# Altium schematic sheet Sheet2.SchDoc
size A0; SheetNumber: 1; SheetTotal: 1
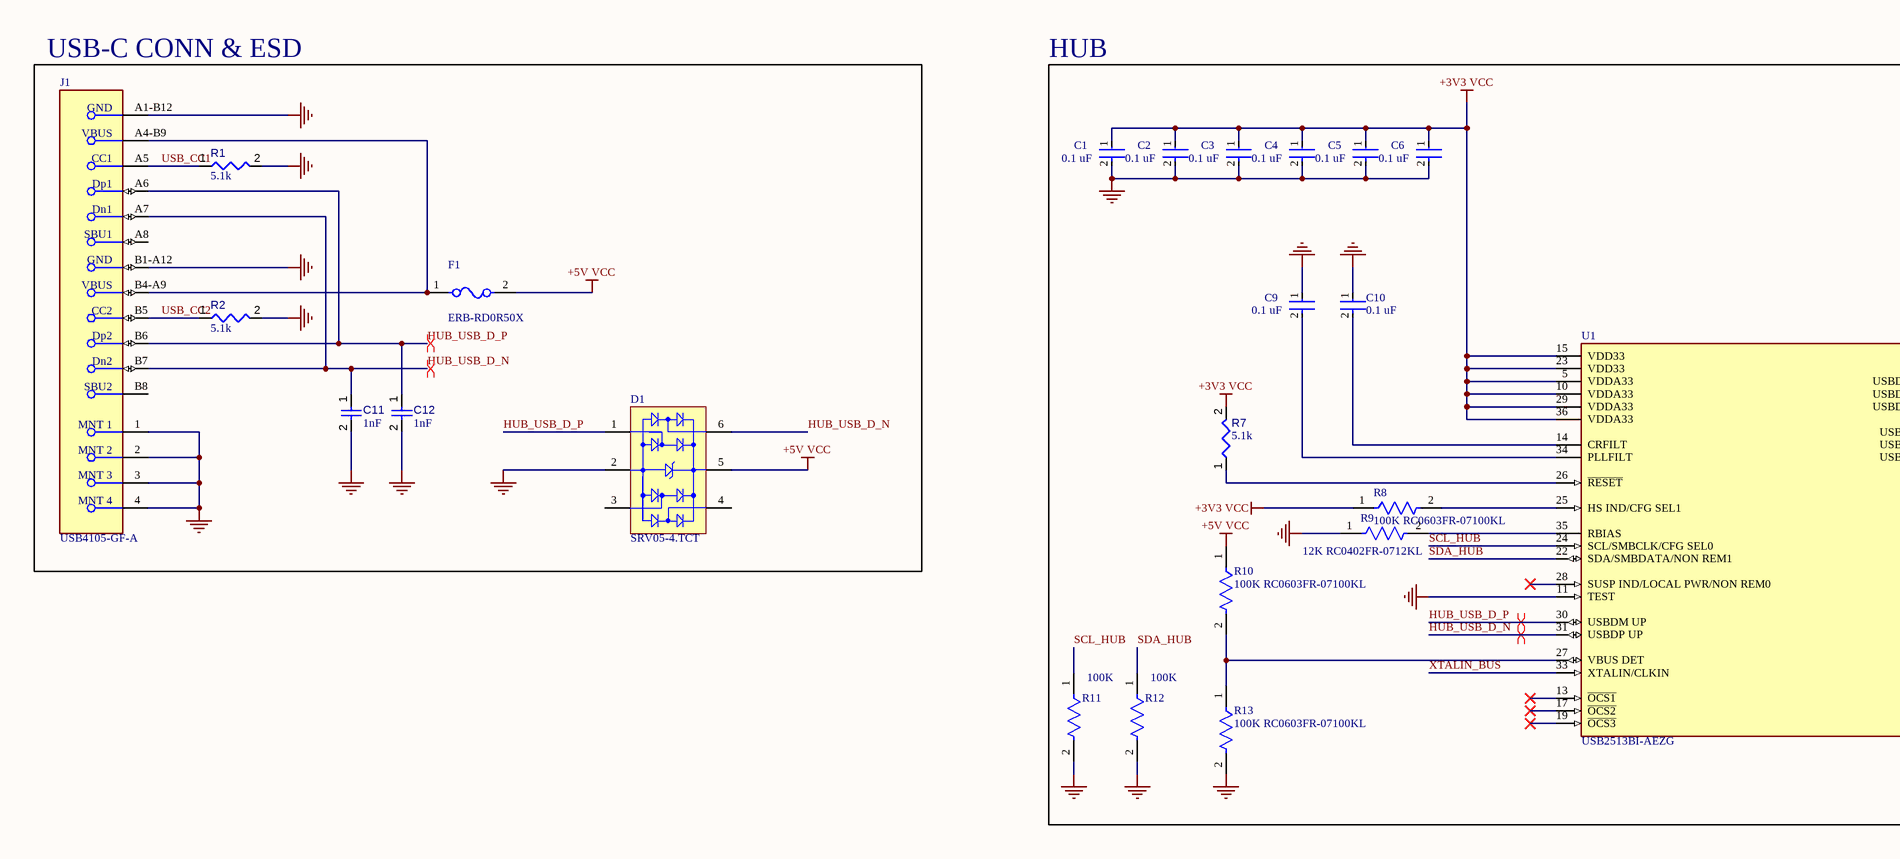
[diagram p0: Sheet2.SchDoc, left]
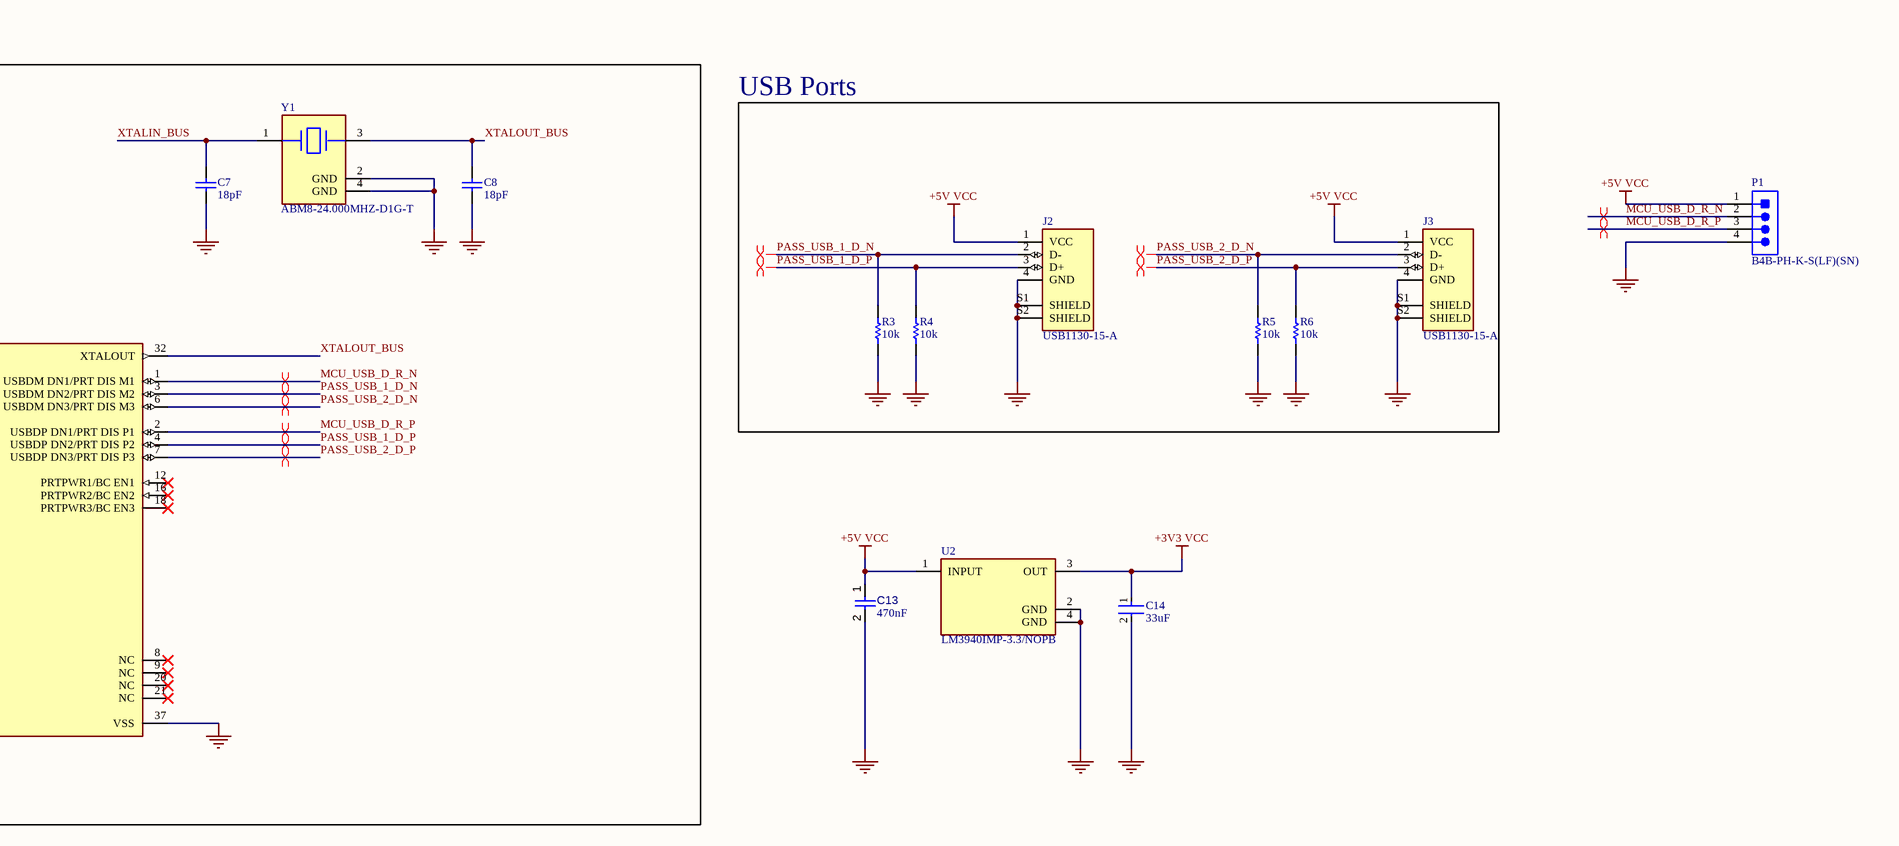
[diagram p1: Sheet2.SchDoc, right]

## Parts
C1  0.1 uF  [FP-GRM15-MFG]
C2  0.1 uF  [FP-GRM15-MFG]
C3  0.1 uF  [FP-GRM15-MFG]
C4  0.1 uF  [FP-GRM15-MFG]
C5  0.1 uF  [FP-GRM15-MFG]
C6  0.1 uF  [FP-GRM15-MFG]
C7  18pF  [CAPC1608X90X35LL10T15]
C8  18pF  [CAPC1608X90X35LL10T15]
C9  0.1 uF  [FP-GRM15-MFG]
C10  0.1 uF  [FP-GRM15-MFG]
C11  value 1nF  [CAPC0402(1005)33_L]  (hidden comment: Capacitor 1nF +/-20% 50V 0402)
C12  value 1nF  [CAPC0402(1005)33_L]  (hidden comment: Capacitor 1nF +/-20% 50V 0402)
C13  value 470nF  [CAPC0603(1608)100_L]  (hidden comment: Capacitor 470nF +/-20% 25V 0603)
C14  33uF  [FP-C2012-125-0_2-IPC_A]
D1  SRV05-4.TCT  [SMTC-SOT23-6_V]
F1  ERB-RD0R50X  [FP-ERBRD-MFG]
J1  USB4105-GF-A  [FP-USB4105-GF-A-MFG]
J2  USB1130-15-A  [GCT_USB1130-15-A_REVA]
J3  USB1130-15-A  [GCT_USB1130-15-A_REVA]
P1  B4B-PH-K-S(LF)(SN)  [JST-B4B-PH-K-S_V]
R1  value 5.1k  [RESC1005X40X25NL05T10]  (hidden comment: RC0402FR-075K1L)
R2  value 5.1k  [RESC1005X40X25NL05T10]  (hidden comment: RC0402FR-075K1L)
R3  10k  [RESC1005X40X25ML05T05]
R4  10k  [RESC1005X40X25ML05T05]
R5  10k  [RESC1005X40X25ML05T05]
R6  10k  [RESC1005X40X25ML05T05]
R7  value 5.1k  [RESC1005X40X25NL05T10]  (hidden comment: RC0402FR-075K1L)
R8  100K RC0603FR-07100KL  [FP-RC0603-0_55-MFG]
R9  12K RC0402FR-0712KL  [FP-RC0402-0_4-IPC_C]
R10  100K RC0603FR-07100KL  [FP-RC0603-0_55-MFG]
R11  100K  [FP-RC0603-0_55-MFG]
R12  100K  [FP-RC0603-0_55-MFG]
R13  100K RC0603FR-07100KL  [FP-RC0603-0_55-MFG]
U1  USB2513BI-AEZG  [FP-USB2513BI-AEZG-MFG]
U2  LM3940IMP-3.3/NOPB  [FP-DCY0004A-MFG]
Y1  ABM8-24.000MHZ-D1G-T  [FP-ABM8-MFG]

## Blocks framed on the sheet
USB-C CONN & ESD: C11 C12 D1 F1 J1 R1 R2
HUB: C1-C10 R7-R13 U1 Y1
USB Ports: J2 J3 R3-R6

## Nets
+3V3 VCC: C1.1 C2.1 C3.1 C4.1 C5.1 C6.1 C14.1 R7.2 R8.1 U1.5(VDDA33) U1.10(VDDA33) U1.15(VDD33) U1.23(VDD33) U1.29(VDDA33) U1.36(VDDA33) U2.3(OUT)
+5V VCC: C13.1 D1.5(VBUS) F1.2 J2.1(VCC) J3.1(VCC) P1.1 R10.1 U2.1(INPUT)
GND: C1.2 C2.2 C3.2 C4.2 C5.2 C6.2 C7.1 C8.1 C9.1 C10.1 C11.2 C12.2 C13.2 C14.2 D1.2(GND) J1.1(MNT_1) J1.2(MNT_2) J1.3(MNT_3) J1.4(MNT_4) J1.A1-B12(GND) J1.B1-A12(GND) J2.4(GND) J2.S1(SHIELD) J2.S2(SHIELD) J3.4(GND) J3.S1(SHIELD) J3.S2(SHIELD) P1.4 R1.2 R2.2 R3.1 R4.1 R5.1 R6.1 R9.1 R11.2 R12.2 R13.2 U1.11(TEST) U1.37(VSS) U2.2(GND) U2.4(GND) Y1.2(GND) Y1.4(GND)
HUB_USB_D_N: C11.1 D1.6(I/O_4) J1.A7(Dn1) J1.B7(Dn2) U1.31(USBDP_UP)
HUB_USB_D_P: C12.1 D1.1(I/O_1) J1.A6(Dp1) J1.B6(Dp2) U1.30(USBDM_UP)
MCU_USB_D_R_N: P1.2 U1.1(USBDM_DN1/PRT_DIS_M1)
MCU_USB_D_R_P: P1.3 U1.2(USBDP_DN1/PRT_DIS_P1)
PASS_USB_1_D_N: J2.2(D-) R3.2 U1.3(USBDM_DN2/PRT_DIS_M2)
PASS_USB_1_D_P: J2.3(D+) R4.2 U1.4(USBDP_DN2/PRT_DIS_P2)
PASS_USB_2_D_N: J3.2(D-) R5.2 U1.6(USBDM_DN3/PRT_DIS_M3)
PASS_USB_2_D_P: J3.3(D+) R6.2 U1.7(USBDP_DN3/PRT_DIS_P3)
SCL_HUB: R11.1 U1.24(SCL/SMBCLK/CFG_SEL0)
SDA_HUB: R12.1 U1.22(SDA/SMBDATA/NON_REM1)
USB_CC1: J1.A5(CC1) R1.1
USB_CC2: J1.B5(CC2) R2.1
XTALIN_BUS: C7.2 U1.33(XTALIN/CLKIN) Y1.1
XTALOUT_BUS: C8.2 U1.32(XTALOUT) Y1.3
NetC9_2: C9.2 U1.34(PLLFILT)
NetC10_2: C10.2 U1.14(CRFILT)
NetF1_1: F1.1 J1.A4-B9(VBUS) J1.B4-A9(VBUS)
NetR7_1: R7.1 U1.26(~{RESET})
NetR8_2: R8.2 U1.25(HS_IND/CFG_SEL1)
NetR9_2: R9.2 U1.35(RBIAS)
NetR10_2: R10.2 R13.1 U1.27(VBUS_DET)

Not connected (* = marked no-connect by the designer): D1 3(I/O_2) 4(I/O_3); J1 A8(SBU1) B8(SBU2); U1 8(NC)* 9(NC)* 12(PRTPWR1/BC_EN1)* 13(~{OCS1})* 16(PRTPWR2/BC_EN2)* 17(~{OCS2})* 18(PRTPWR3/BC_EN3)* 19(~{OCS3})* 20(NC)* 21(NC)* 28(SUSP_IND/LOCAL_PWR/NON_REM0)*

## Layout directives
differential pair: HUB_USB_D_N, HUB_USB_D_P, MCU_USB_D_R_N, MCU_USB_D_R_P, PASS_USB_1_D_N, PASS_USB_1_D_P, PASS_USB_2_D_N, PASS_USB_2_D_P

## Library data of the parts
C1-C6 C9 = CMP-2100-03641-2: CAP CER 0.1UF 16V X7R 0402 / GRM155R71C104KA88D; Manufacturer: Murata; Standoff Height: 0mm; Tolerance: 10%; Voltage Rating: 16Vdc; Material: Ceramic; Capacitance: 0.10μF; Value: 0.10μF; RoHS: TRUE; Manufacturer Part Number: GRM155R71C104KA88D; Temperature Characteristic: X7R; Octopart: https://octopart.com/grm155r71c104ka88d-murata-196880; Digikey Description: CAP CER 0.1UF 16V X7R 0402; Device Class L3: Ceramic Capacitors; Height: 0.55mm; ComponentLink2Description: Datasheet; Temperature Range Low: -55°C; Ipc Land Pattern Name: CAPC10050X219; ComponentLink2URL: https://search.murata.co.jp/Ceramy/image/img/A01X/G101/ENG/GRM155R71H471KA01-01A.pdf; Device Class L1: Passive Components; Lead Free: yes; Category: Cap; Package: GRM15; Temperature: -55°C to +125°C; Device Class L2: Capacitors; Temperature Range High: +125°C; Mouser Description: 0402 0.1 uF 16V ±10 % Tolerance X7R SMT Multilayer Ceramic Capacitor
C7 C8 = CMP-2000-06334-1: Chip Capacitor, 18 pF, +/- 5%, 50 V, -55 to 125 degC, 0603 (1608 Metric), RoHS, Tape and Reel / GRM1885C1H180JA01D; Manufacturer: Murata; Voltage - Rated: 50V; Online Catalog: GRMSeries; Temperature Coefficient: C0G,NP0; Other Names: 490-1409-2GRM39C0G180J050AD; Capacitance: 18pF; Package / Case: 0603(1608Metric); Package Reference: 0603; Height - Seated (Max): -; Package Description: 2-Pin Surface Mount Device, Body 1.6 x 0.8 mm; Category: Capacitors; Applications: GeneralPurpose; Size / Dimension: 0.063"Lx0.031"W(1.60mmx0.80mm); Mounting Type: SurfaceMount,MLCC; Family: CeramicCapacitors; Packaging: Tape&Reel(TR); Tolerance: ±5%; Ratings: -; Operating Temperature: -55°C~125°C; Datasheet URL: http://search.murata.co.jp/Ceramy/image/img/A01X/G101/ENG/GRM1885C1H180JA01-01.pdf; Standard Package: 4,000; Lead Style: -; Thickness (Max): 0.035"(0.90mm); Manufacturer URL: http://www.murata.com/; Mounting Technology: SurfaceMount; Lead Spacing: -; Series: GRM; Features: -; Datasheet Version: 03/2016
C10 = CMP-2100-03641-2: CAP CER 0.1UF 16V X7R 0402; Manufacturer Part Number: GRM155R71C104KA88D; Manufacturer: Murata; Standoff Height: 0mm; Tolerance: 10%; Voltage Rating: 16Vdc; Material: Ceramic; Capacitance: 0.10μF; Value: 0.10μF; RoHS: TRUE; Temperature Characteristic: X7R; Octopart: https://octopart.com/grm155r71c104ka88d-murata-196880; Digikey Description: CAP CER 0.1UF 16V X7R 0402; Device Class L3: Ceramic Capacitors; Height: 0.55mm; ComponentLink2Description: Datasheet; Temperature Range Low: -55°C; Ipc Land Pattern Name: CAPC10050X219; ComponentLink2URL: https://search.murata.co.jp/Ceramy/image/img/A01X/G101/ENG/GRM155R71H471KA01-01A.pdf; Device Class L1: Passive Components; Lead Free: yes; Category: Cap; Package: GRM15; Temperature: -55°C to +125°C; Device Class L2: Capacitors; Temperature Range High: +125°C; Mouser Description: 0402 0.1 uF 16V ±10 % Tolerance X7R SMT Multilayer Ceramic Capacitor
C11 C12 = CMP-001-00066-3: Chip Capacitor, 1nF +/-20%, 50V, 0402, Thickness 0.33 mm; Tolerance: 10%; Case/Package: 0402; Pins: 2; Min Operating Temperature: -55°C; Max Operating Temperature: 85°C; Voltage Rating: 50V; Mounting Technology: SMT
C13 = CMP-001-00077-3: Chip Capacitor, 470nF +/-20%, 25V, 0603, Thickness 1 mm; Tolerance: 10%; Max Operating Temperature: 85°C; Voltage Rating: 25V; Pins: 2; Case/Package: 0603; Mounting Technology: SMT; Min Operating Temperature: -55°C
C14 = CMP-08246-003796-1: Multilayer Ceramic Capacitors 33μF ±20% 6.3V X5R SMD 0805 / C2012X5R0J336M125AC; Series: C; Capacitance: 33uF; Min Operating Temperature: -55°C; Depth: 1.25mm; Radiation Hardening: No; Package Quantity: 1; Height: 1.25mm; Max Operating Temperature: 85°C; REACH SVHC: No SVHC; Mount: Surface Mount; Construction: Flat; Case/Package: 0805; Dielectric Material: Ceramic; Thickness: 0.057inch; Case Code (Imperial): 0805; Lead Free: Lead Free; Weight: 0.000194oz; Case Code (Metric): 2012; Tolerance: 20%; Dielectric: X5R; RoHS Compliant: Yes; Length: 2mm; Packaging: Tape and Reel; Voltage Rating (DC): 6.3V; Width: 1.2mm; Resistor Type: Ceramic; Termination: SMD/SMT; Voltage Rating: 6.3V
D1 = CMP-2000-05358-1: RailClamp(R) Low Capacitance TVS Diode Array, 5 pF, 17.5 VC, -55 to 125 degC, 6-Pin SOT23, RoHS, Tape and Reel; Manufacturer: Semtech; Leakage Current (Max): 5uA; Polarity: Uni-Directional; Peak Pulse Power Dissipation: 300W; Clamping Voltage: 17.5V; Number of Elements: 1; Working Voltage: 5V; Test Current (It): 1mA; Configuration: Quad; Reverse Breakdown Voltage: 6V; Suppressor Type: DiodeArrays; Peak Pulse Current: 12A; Product Depth (mm): 1.6mm; Product Height (mm): 1.15mm; Clamping Voltage (Max): 12.5V; Rad Hardened: No; Product Length (mm): 2.9mm; Capacitance Value: 5pF; Mounting: SurfaceMount; Datasheet URL: https://datasheet.ciiva.com/8029/srv05-4-8029973.pdf; Datasheet Version: Jan-08; Packaging: TapeandReel; Package / Case: SOT-23; Operating Temp Range: -55Cto125C; Pin Count: 6; Direction Type: Uni-Directional; Operating Temperature Min Deg. C: -55C; Reverse Stand-off Voltage: 5V; Leakage Current: 5uA; Manufacturer URL: http://www.semtech.com/; Working Voltage (Max): 5V; Package Reference: SOT23-6; Package Description: 6-Pin Small Outline Transistor, Body 2.9 x 1.6 mm, Pitch 0.95 mm; Operating Temperature Max Deg. C: 125C; Operating Temperature Classification: Military; Mounting Style: SurfaceMount
F1 = CMP-05590-000002-1: FUSE BOARD MNT 500MA 32VDC 0402; Manufacturer: Panasonic Electronic Components; Fuse Current: 0.5A; Fuse Blow Speed: Fast; Voltage Rating: 32V; Value: 310mΩ; Fuse Interrupt Dc Current: 35A; RoHS: TRUE; ComponentLink2Description: Datasheet; Temperature Range High: +125°C; Temperature: -40°C to +125°C; Mouser Description: Fuse Chip Fast Acting 0.5A 32V SMD Solder Pad 0402 1 X 0.5 X 0.39mm T/R UL/cUL; Digikey Description: FUSE BOARD MNT 500MA 32VDC 0402; Device Class L2: Fuses; Temperature Range Low: -40°C; Ipc Land Pattern Name: CAPC10050X39; Octopart: https://octopart.com/erb-rd0r50x-panasonic-21220527; Category: Fuse; Automotive: No; Device Class L3: unset; Lead Free: Yes; Package: ERBRD; Max Fuse Dc Voltage: 32V; Device Class L1: Circuit Protection; Manufacturer Part Number: ERB-RD0R50X; ComponentLink2URL: https://industrial.panasonic.com/cdbs/www-data/pdf/AFA0000/AFA0000C7.pdf; Height: 0.49mm; Resistance: 310mΩ
J1 = CMP-002-00072-1: Conn USB 2.0 Type C RCP 24 POS 0.3mm/0.5mm Solder RA SMD 24 Terminal 1 Port T/R Adjusted for JLCPCB
J2 J3 = CMP-002-00071-1: USB 2.0 Connector Full size Horizontal Plug, type A, 4 Pins, Through hole, Top mount, 6.99mm profile, High mating cycle, charging receptacle; MF: Global Connector Technology; Case/Package: None; Pins: 6; Purchase-URL: https://pricing.snapeda.com/search/part/USB1130-15-A/?ref=eda; Component Type: Standard; Source: USB1130-15-A_REVA.SchLib; Value: *; Check_prices: https://www.snapeda.com/parts/USB1130-15-A/Global+Connector+Technology/view-part/?ref=eda; SnapEDA_Link: https://www.snapeda.com/parts/USB1130-15-A/Global+Connector+Technology/view-part/?ref=snap; Price: None; Availability: In Stock; MP: USB1130-15-A; Design Item ID: USB1130-15-A_REVA
P1 = CMP-2000-05165-1: Male Header, Pitch 2 mm, 1 x 4 Position, Height 6 mm, Tail Length 3.4 mm, -25 to 85 degC, RoHS, Bulk; Manufacturer: JST; No of Positions: 4; Style/Orientation: StraightHeader/Plug; Pitch: 2mm; Datasheet URL: http://datasheet.octopart.com/B4B-PH-K-S%28LF%29%28SN%29-JST-datasheet-10558886.pdf; Type: ShroudedHeader; Manufacturer URL: http://www.jst.com/home2.html; Termination: Crimp; Datasheet Version: Apr-09
R1 R2 R7 = CMP-009-00178-1: Fixed Resistor, Metal Glaze/thick Film, 0.0625W, 5100ohm, 50V, 1% +/-Tol, 100ppm/Cel, Surface Mount, 0402; Additional Feature: LASER TRIMMABLE; Power: 62.5mW; Pins: 2; Construction: Chip; Tolerance: 1%; JESD-609 Code: e3; RoHS Compliant: Yes; Mounting Technology: Surface Mount; Min Operating Temperature: -55°C; Case/Package: 0402; Max Operating Temperature: 155°C
R3-R6 = CMP-2002-00433-1: ERJ-2GEJ103X / 10kohm resistor; Manufacturer: Panasonic; Part Number: ERJ-2GEJ103X
R8 R10-R13 = CMP-2100-03662-2: RES SMD 100K OHM 1% 1/10W 0603; Voltage Rating (DC): 50V; Resistance: 100kR; Max Power Dissipation: 100mW; Temperature Coefficient: 100ppm/°C; Working Voltage: 75V; Length: 1.6mm; Lead Free: Lead Free; Number of Terminations: 2; Packaging: Tape and Reel; Voltage Rating: 50V; Termination: SMD/SMT; Width: 0.8mm; Resistor Type: Thick Film; Resistance Tolerance: 1%; Features: Moisture Resistant; Height: 0.45mm; Construction: Rectangular; Case/Package: 0603; Military Standard: Not; Case Code (Imperial): 0603; Series: RC; Technology: THICK FILM; Depth: 0.8mm; RoHS Compliant: Yes; REACH SVHC: No SVHC; Min Operating Temperature: -55°C; Case Code (Metric): 1608; Max Operating Temperature: 155°C; Power Rating: 100mW; Number of Pins: 2; Tolerance: 1%
R9 = CMP-2002-07378-2: RES SMD 12K OHM 1% 1/16W 0402; Power Rating: 62.5mW; Voltage Rating: 50V; Resistance: 12kR; Max Power Dissipation: 63mW; Temperature Coefficient: 100ppm/°C; Construction: Rectangular; Case Code (Metric): 1005; Package Quantity: 1; Weight: 2.3E-05oz; RoHS Compliant: Yes; Packaging: Tape and Reel; Case Code (Imperial): 0402; Military Standard: Not; Min Operating Temperature: -55°C; Depth: 0.5mm; Length: 1mm; Width: 0.02inch; Termination: SMD/SMT; Lead Free: Lead Free; Tolerance: 1%; REACH SVHC: No SVHC; Size Code: 0402; Resistance Tolerance: 1%; Series: RC; Max Operating Temperature: 155°C; Height: 0.016inch; Features: Moisture Resistant; Number of Terminations: 2; Case/Package: 0402; Resistor Type: Thick Film
U1 = CMP-06284-000012-1: IC USB 2.0 3PORT HUB CTLR 36QFN; Manufacturer: Microchip; Min Supply Voltage: 3V; Usb Standard: USB 2.0; Interface: I2C,USB,SMBus; Nominal Supply Current: 35-65mA; Standoff Height: 0mm; Number Of Ports: 3; Max Supply Voltage: 3.6V; Lead Free: Yes; Temperature Range High: +85°C; Digikey Description: IC USB 2.0 3PORT HUB CTLR 36QFN; Height: 1mm; ComponentLink2Description: Datasheet; RoHS: TRUE; Device Class L1: Integrated Circuits (ICs); Ambient Temperature Range High: +85°C; Octopart: https://octopart.com/usb2513bi-aezg-microchip-24995419; Ipc Land Pattern Name: QFN50P600X600X90-36; Device Class L2: Interface ICs; Category: IC; Temperature: -40°C to +85°C; Mouser Description: USB2412 Series 2-Port USB 2.0 Hi-Speed Hub Controller - VQFN-36; Device Class L3: USB Interface ICs; Manufacturer Part Number: USB2513BI-AEZG; Package: USB2513BI-AEZG; Ambient Temperature Range Low: -40°C; Temperature Range Low: -40°C; Automotive: No; ComponentLink2URL: http://ww1.microchip.com/downloads/en/DeviceDoc/00001692C.pdf
U2 = CMP-0062-01788-4: IC REG LINEAR 3.3V 1A SOT223-4; Min Input Voltage: 4.5V; Max Supply Voltage: 7.5V; Number of Outputs: 1; Output Type: Fixed; Polarity: Positive; Dropout Voltage: 500mV; Quiescent Current: 15mA; Max Output Voltage: 3.3V; Length: 6.5mm; Termination: SMD/SMT; Width: 3.56mm; Min Supply Voltage: 4.5V; Max Output Current: 1A; Case/Package: SOT-223; Output Voltage: 3.3V; Current Rating: 1A; Packaging: Tape and Reel; Lead Free: Lead Free; Nominal Output Voltage: 3.3V; Height: 1.6mm; Series: -; Output Configuration: Positive; Radiation Hardening: No; Number of Regulators: 1; Package Quantity: 1000; REACH SVHC: No SVHC; Max Input Voltage: 7.5V; Max Operating Temperature: 125°C; Min Operating Temperature: -40°C; Output Current: 1A; Contact Plating: Tin; Number of Pins: 4; Mount: Surface Mount
Y1 = CMP-27762-011059-1: Crystal 24MHz ±10ppm 18pF SMD-4 3.2mm x 2.5mm; RoHS Compliant: Yes